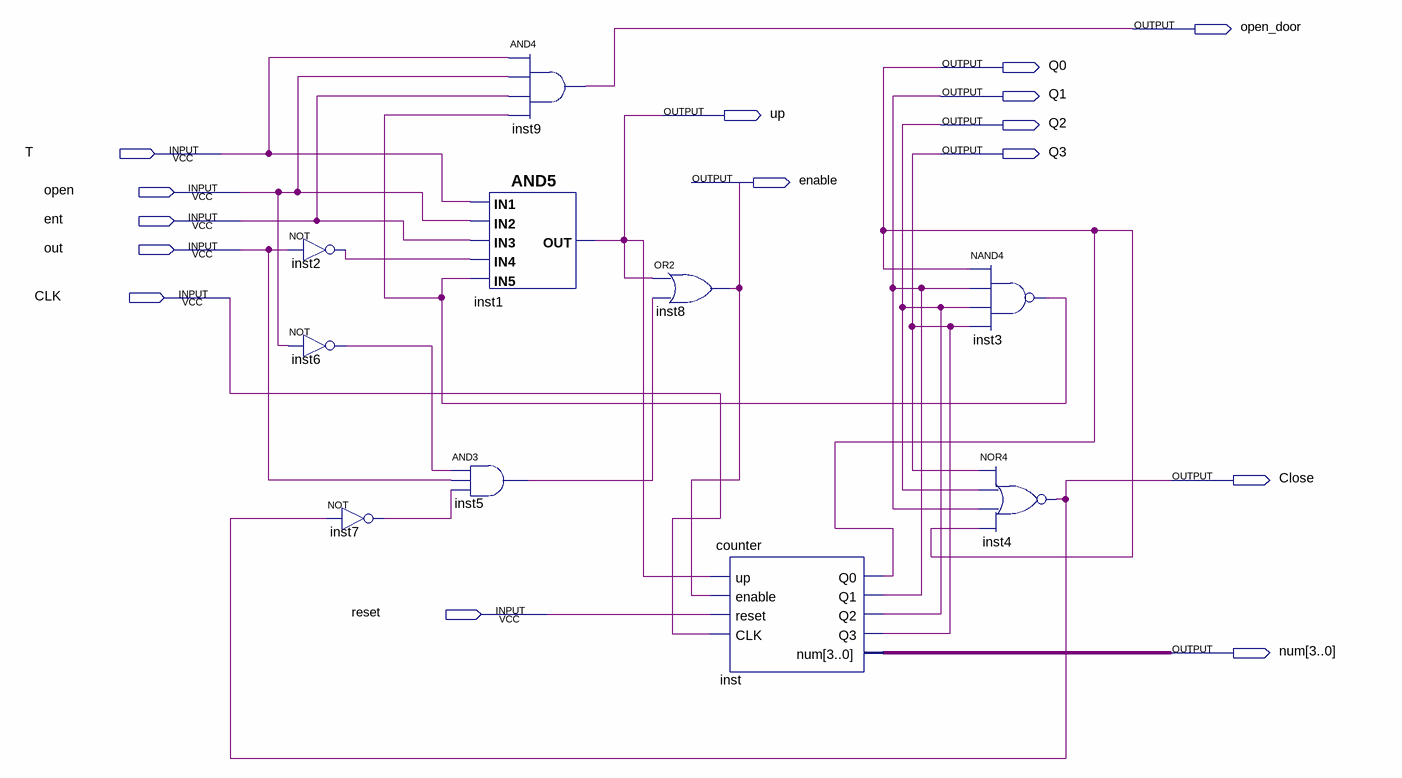
[diagram p0: schematic sheet]
// Quartus schematic waiting_room.bdf as structural Verilog: 10 symbols, 15 pins
module waiting_room (
  input  T,
  input  open,
  input  ent,
  input  out,
  input  CLK,
  input  reset,
  output open_door,
  output Q0,
  output Q1,
  output up,
  output Q2,
  output Q3,
  output enable,
  output Close,
  output [3:0] num
);

  wire inst2_out, inst3_out, inst5_out, inst6_out, inst7_out;

  not inst2 (inst2_out, out);
  not inst6 (inst6_out, open);
  not inst7 (inst7_out, Close);
  and inst9 (open_door, T, open, ent, inst3_out);
  and inst1 (up, T, open, ent, inst2_out, inst3_out);
  and inst5 (inst5_out, inst6_out, out, inst7_out);
  or inst8 (enable, up, inst5_out);
  counter inst (.up(up), .enable(enable), .reset(reset), .CLK(CLK), .Q0(Q0), .Q1(Q1), .Q2(Q2), .Q3(Q3), .num(num));
  nand inst3 (inst3_out, Q0, Q1, Q2, Q3);
  nor inst4 (Close, Q3, Q2, Q1, Q0);
endmodule
